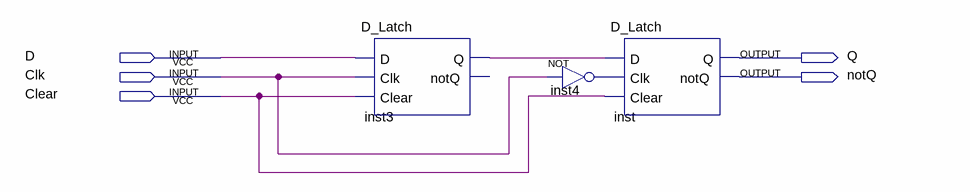
[diagram p0: schematic sheet]
// Quartus schematic D_FlipFlop.bdf as structural Verilog: 3 symbols, 5 pins
module D_FlipFlop (
  input  D,
  input  Clk,
  input  Clear,
  output Q,
  output notQ
);

  wire inst3_q, inst4_out;

  D_Latch inst3 (.D(D), .Clk(Clk), .Clear(Clear), .Q(inst3_q));  // open: notQ
  not inst4 (inst4_out, Clk);
  D_Latch inst (.D(inst3_q), .Clk(inst4_out), .Clear(Clear), .Q(Q), .notQ(notQ));
endmodule
